# Altium schematic sheet SIXXY_00.SchDoc: Sixxy Micro
size A3; Date: 21/01/2019; DrawnBy: Wim Van Gool; Revision: 00; SheetNumber: 1; SheetTotal: 1; PageSetup: Record=PageOptions|CenterHorizontal=True|CenterVertical=True|PrintScale=0.70|XCorrection=1.00|YCorrection=1.00|PrintKind=1|BorderSize=5000000|LeftOffset=0|BottomOffset=0|Orientation=2|PaperLength=1000|PaperWidth=1000|Scale=100|PaperSource=15|PrintQuality=600|MediaType=1|DitherType=10|PrintScaleMode=1|PaperKind=A4 (210 x 297 mm)|PaperIndex=9
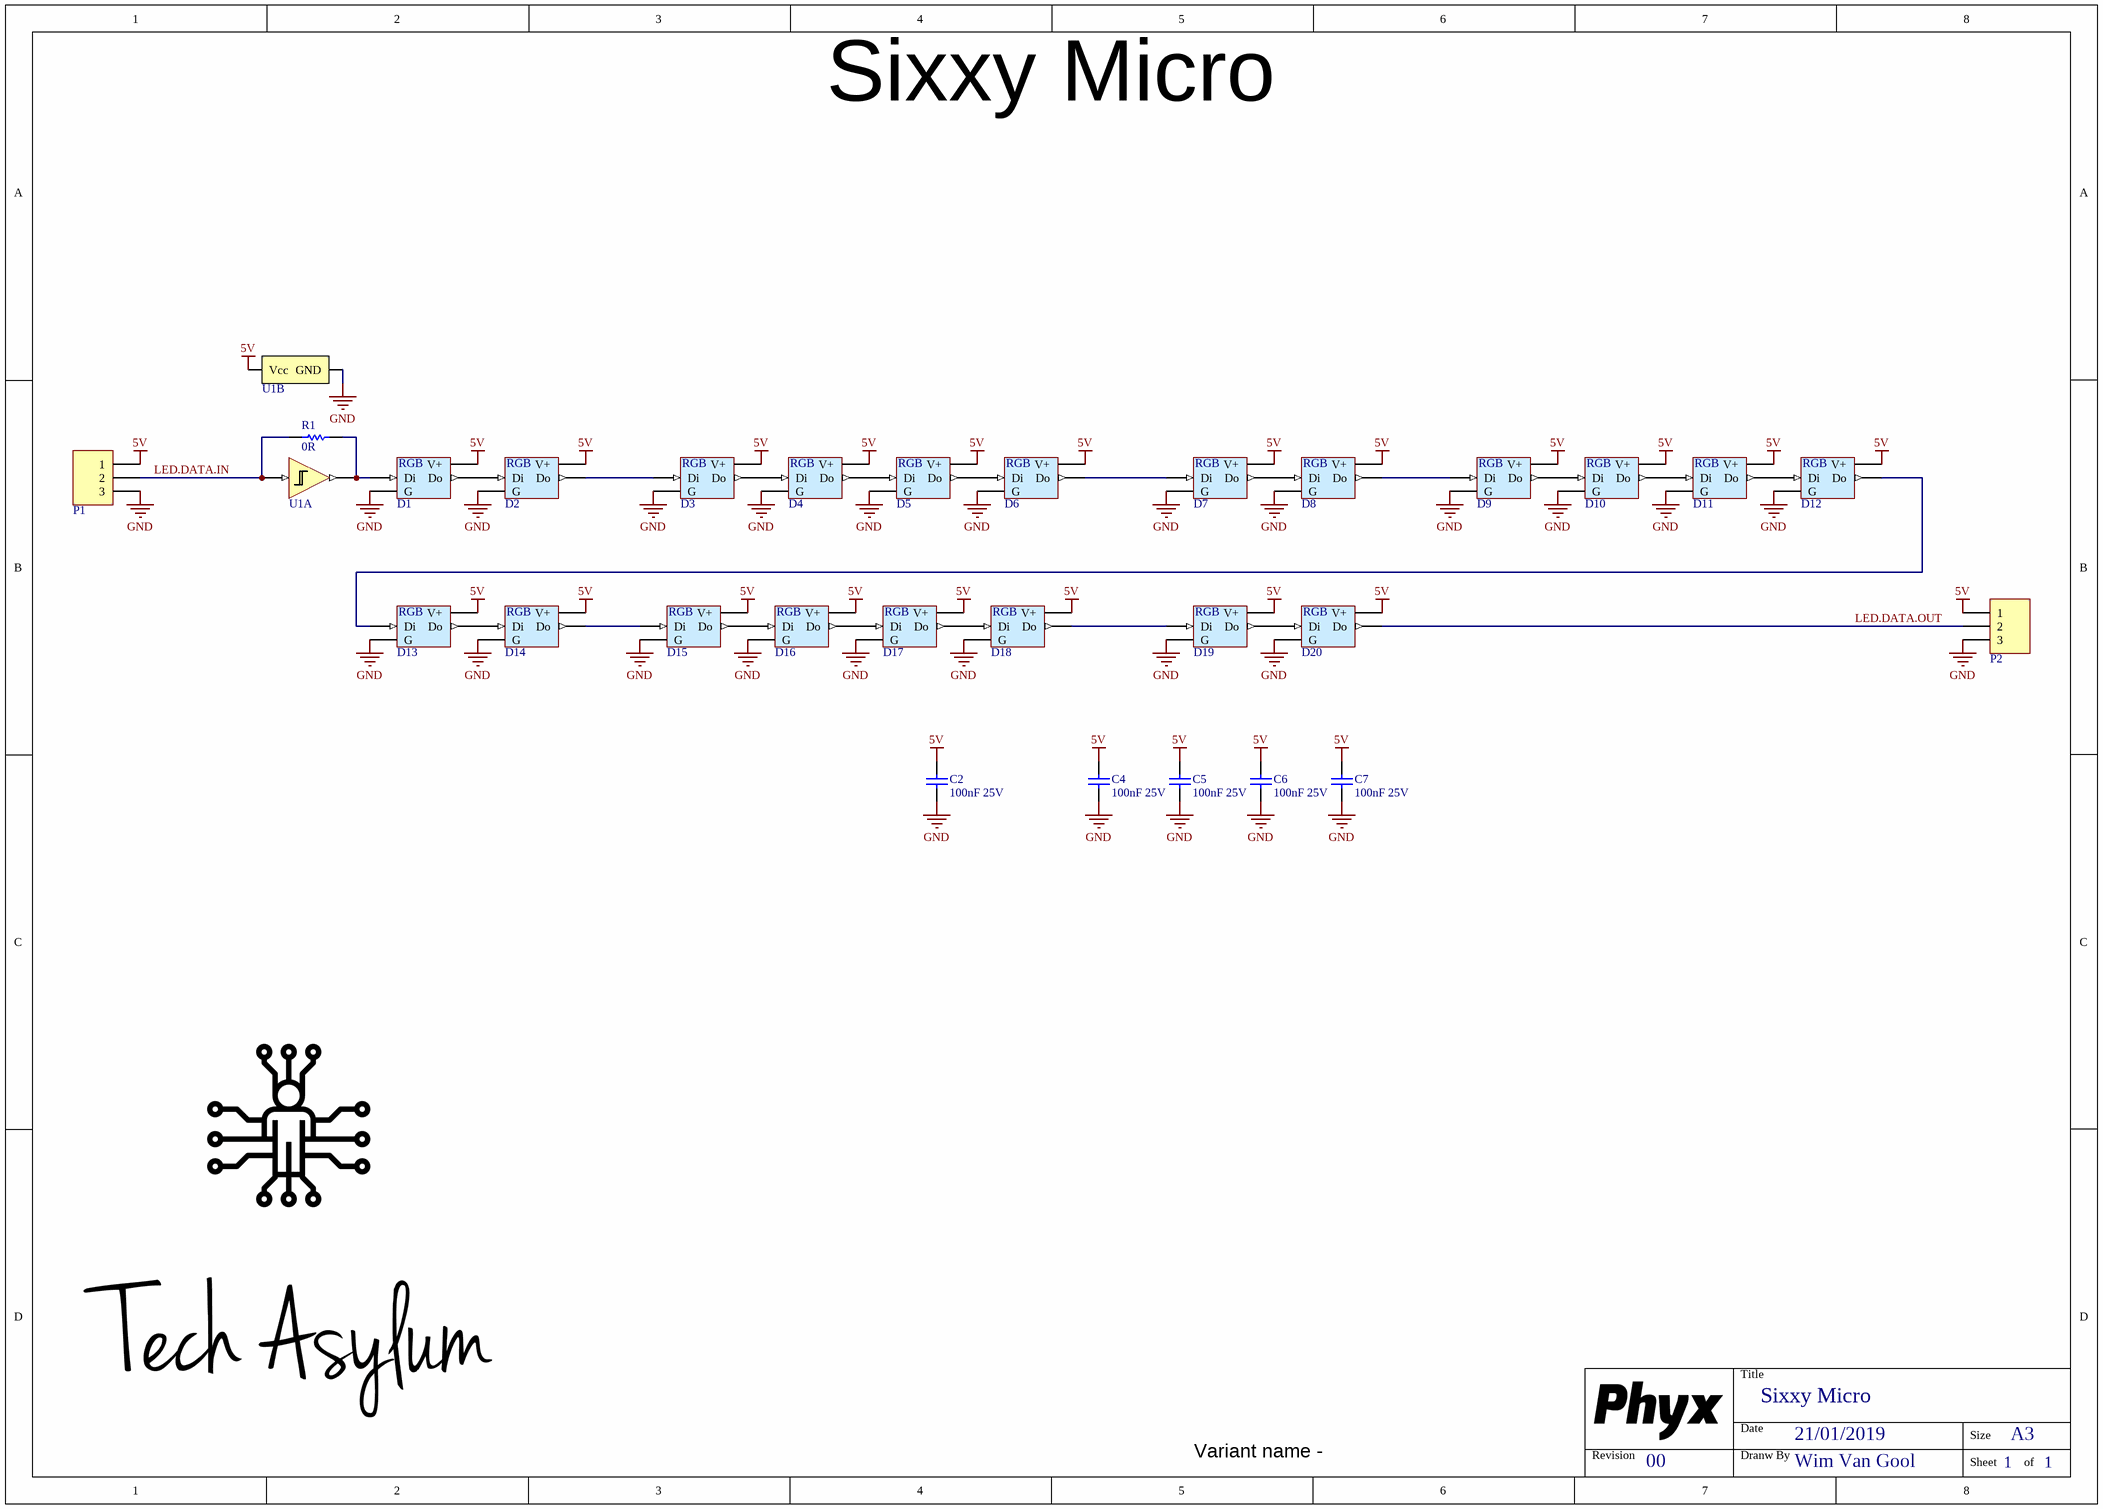
[diagram p0: SIXXY_00.SchDoc]

## Parts
C2  value 100nF 25V  [C0603_N]  (hidden comment: CAP_CERAMIC)
C4  value 100nF 25V  [C0603_N]  (hidden comment: CAP_CERAMIC)
C5  value 100nF 25V  [C0603_N]  (hidden comment: CAP_CERAMIC)
C6  value 100nF 25V  [C0603_N]  (hidden comment: CAP_CERAMIC)
C7  value 100nF 25V  [C0603_N]  (hidden comment: CAP_CERAMIC)
D1  WS2812 based digital RGB LED 2022 package  [LED_2022_WS2812B]  (value not drawn)
D2  WS2812 based digital RGB LED 2022 package  [LED_2022_WS2812B]  (value not drawn)
D3  WS2812 based digital RGB LED 2022 package  [LED_2022_WS2812B]  (value not drawn)
D4  WS2812 based digital RGB LED 2022 package  [LED_2022_WS2812B]  (value not drawn)
D5  WS2812 based digital RGB LED 2022 package  [LED_2022_WS2812B]  (value not drawn)
D6  WS2812 based digital RGB LED 2022 package  [LED_2022_WS2812B]  (value not drawn)
D7  WS2812 based digital RGB LED 2022 package  [LED_2022_WS2812B]  (value not drawn)
D8  WS2812 based digital RGB LED 2022 package  [LED_2022_WS2812B]  (value not drawn)
D9  WS2812 based digital RGB LED 2022 package  [LED_2022_WS2812B]  (value not drawn)
D10  WS2812 based digital RGB LED 2022 package  [LED_2022_WS2812B]  (value not drawn)
D11  WS2812 based digital RGB LED 2022 package  [LED_2022_WS2812B]  (value not drawn)
D12  WS2812 based digital RGB LED 2022 package  [LED_2022_WS2812B]  (value not drawn)
D13  WS2812 based digital RGB LED 2022 package  [LED_2022_WS2812B]  (value not drawn)
D14  WS2812 based digital RGB LED 2022 package  [LED_2022_WS2812B]  (value not drawn)
D15  WS2812 based digital RGB LED 2022 package  [LED_2022_WS2812B]  (value not drawn)
D16  WS2812 based digital RGB LED 2022 package  [LED_2022_WS2812B]  (value not drawn)
D17  WS2812 based digital RGB LED 2022 package  [LED_2022_WS2812B]  (value not drawn)
D18  WS2812 based digital RGB LED 2022 package  [LED_2022_WS2812B]  (value not drawn)
D19  WS2812 based digital RGB LED 2022 package  [LED_2022_WS2812B]  (value not drawn)
D20  WS2812 based digital RGB LED 2022 package  [LED_2022_WS2812B]  (value not drawn)
P1  Header 1.0mm RA Shrouded 3  [WE_665103131822]  (value not drawn)
P2  Header 1.0mm RA Shrouded 3  [WE_665103131822]  (value not drawn)
R1  value 0R  [R0603_N]  (hidden comment: RESISTOR)
U1  SN74LVC1G17DCKR  Buffer, Schmitt Trigger, 1.65V to 5.5V  [TI_DCK_R-PDSO-G5]  (value not drawn)  (parts A,B of 2)

## Nets
5V: C2.1 C4.1 C5.1 C6.1 C7.1 D1.4(V+) D2.4(V+) D3.4(V+) D4.4(V+) D5.4(V+) D6.4(V+) D7.4(V+) D8.4(V+) D9.4(V+) D10.4(V+) D11.4(V+) D12.4(V+) D13.4(V+) D14.4(V+) D15.4(V+) D16.4(V+) D17.4(V+) D18.4(V+) D19.4(V+) D20.4(V+) P1.1 P2.1 U1.5(Vcc)
GND: C2.2 C4.2 C5.2 C6.2 C7.2 D1.2(G) D2.2(G) D3.2(G) D4.2(G) D5.2(G) D6.2(G) D7.2(G) D8.2(G) D9.2(G) D10.2(G) D11.2(G) D12.2(G) D13.2(G) D14.2(G) D15.2(G) D16.2(G) D17.2(G) D18.2(G) D19.2(G) D20.2(G) P1.3 P2.3 U1.3(GND)
LED.DATA.IN: P1.2 R1.2 U1.2(A)
LED.DATA.OUT: D20.1(Do) P2.2
NetD1_1: D1.1(Do) D2.3(Di)
NetD1_3: D1.3(Di) R1.1 U1.4(Y)
NetD2_1: D2.1(Do) D3.3(Di)
NetD3_1: D3.1(Do) D4.3(Di)
NetD4_1: D4.1(Do) D5.3(Di)
NetD5_1: D5.1(Do) D6.3(Di)
NetD6_1: D6.1(Do) D7.3(Di)
NetD7_1: D7.1(Do) D8.3(Di)
NetD8_1: D8.1(Do) D9.3(Di)
NetD9_1: D9.1(Do) D10.3(Di)
NetD10_1: D10.1(Do) D11.3(Di)
NetD11_1: D11.1(Do) D12.3(Di)
NetD12_1: D12.1(Do) D13.3(Di)
NetD13_1: D13.1(Do) D14.3(Di)
NetD14_1: D14.1(Do) D15.3(Di)
NetD15_1: D15.1(Do) D16.3(Di)
NetD16_1: D16.1(Do) D17.3(Di)
NetD17_1: D17.1(Do) D18.3(Di)
NetD18_1: D18.1(Do) D19.3(Di)
NetD19_1: D19.1(Do) D20.3(Di)

## Notes on the sheet
- Title
- Variant name -
- Revision
- Date
- Dranw By
- Size
- A3
- Sheet
- of
- (in symbol LED # RGB WS2812B-2022) RGB

## Library data of the parts
C2 C4-C7 = CAP # 100nF 25V 0603: Capacitor Ceramic; Supplier 1: Farnell; Supplier Part Number 1: 1759037
D1-D20 = LED # RGB WS2812B-2022: =Description; Value: WS2812B-2022; Supplier 1: Aliexpress; Supplier Part Number 1: WS2812B 2020 2022
P1 P2 = HDR # RA SHR 1.0mm 3way - 665103131822: Value: 665103131822; Supplier 1: Wurth; Supplier Part Number 1: 665103131822
R1 = RES # 0R 0603: Supplier 1: Farnell; Supplier Part Number 1: 2447743
U1 = BUF # 1 SN74LVC1G17DCKR: =Description; Value: SN74LVC1G17DCKR; Supplier 1: Farnell; Supplier Part Number 1: 1287609